# EAGLE design rcps2keyb_v2 (EAGLE 9.6.2)
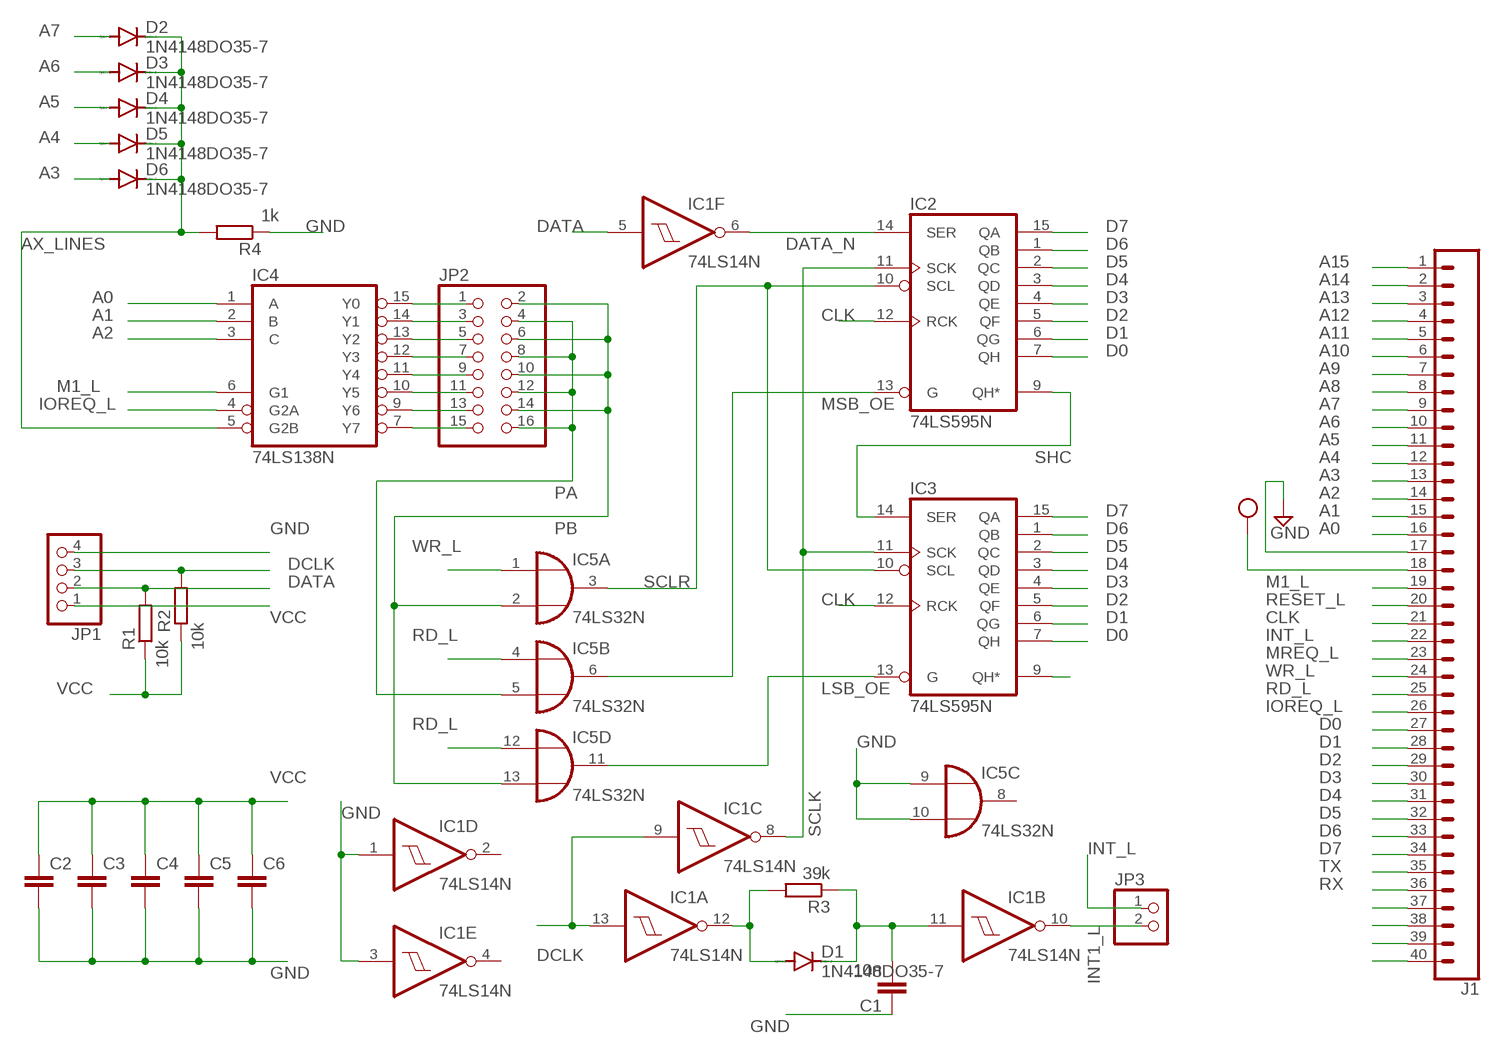
[diagram p0: schematic, sheet 1]

## Parts
C1  10n  C-EU050-025X075  [C050-025X075]
C2  C-EU050-025X075  [C050-025X075]
C3  C-EU050-025X075  [C050-025X075]
C4  C-EU050-025X075  [C050-025X075]
C5  C-EU050-025X075  [C050-025X075]
C6  C-EU050-025X075  [C050-025X075]
D1  1N4148DO35-7  [DO35-7]
D2  1N4148DO35-7  [DO35-7]
D3  1N4148DO35-7  [DO35-7]
D4  1N4148DO35-7  [DO35-7]
D5  1N4148DO35-7  [DO35-7]
D6  1N4148DO35-7  [DO35-7]
IC1  74LS14N  [DIL14]
IC2  74LS595N  [DIL16]
IC3  74LS595N  [DIL16]
IC4  74LS138N  [DIL16]
IC5  74LS32N  [DIL14]
J1  CONN_40OFFSET  [1X40_OFFSET]
JP1  PINHD-1X4  [1X04]
JP2  PINHD-2X8  [2X08]
JP3  PINHD-1X2  [1X02]
R1  10k  R-EU_0204/7  [0204/7]
R2  10k  R-EU_0204/7  [0204/7]
R3  39k  R-EU_0204/7  [0204/7]
R4  1k  R-EU_0204/7  [0204/7]

## Nets
A0: IC4.1(A) J1.16
A1: IC4.2(B) J1.15
A2: IC4.3(C) J1.14
A3: D6.A J1.13
A4: D5.A J1.12
A5: D4.A J1.11
A6: D3.A J1.10
A7: D2.A J1.9
A8: J1.8
A9: J1.7
A10: J1.6
A11: J1.5
A12: J1.4
A13: J1.3
A14: J1.2
A15: J1.1
AX_LINES: D2.C D3.C D4.C D5.C D6.C IC4.5(G2B) R4.2
CLK: IC2.12(RCK) IC3.12(RCK) J1.21
D0: IC2.7(QH) IC3.7(QH) J1.27
D1: IC2.6(QG) IC3.6(QG) J1.28
D2: IC2.5(QF) IC3.5(QF) J1.29
D3: IC2.4(QE) IC3.4(QE) J1.30
D4: IC2.3(QD) IC3.3(QD) J1.31
D5: IC2.2(QC) IC3.2(QC) J1.32
D6: IC2.1(QB) IC3.1(QB) J1.33
D7: IC2.15(QA) IC3.15(QA) J1.34
DATA: IC1.5(F:I) JP1.2 R1.2
DATA_N: IC1.6(F:O) IC2.14(SER)
DCLK: IC1.9(C:I) IC1.13(A:I) JP1.3 R2.2
GND: C1.1 C2.2 C3.2 C4.2 C5.2 C6.2 IC1.1(D:I) IC1.3(E:I) IC5.9(C:I0) IC5.10(C:I1) J1.17 JP1.4 R4.1
INT1_L: IC1.10(B:O) JP3.2
INT_L: J1.22 JP3.1
IOREQ_L: IC4.4(G2A) J1.26
LSB_OE: IC3.13(G) IC5.11(D:O)
M1_L: IC4.6(G1) J1.19
MREQ_L: J1.23
MSB_OE: IC2.13(G) IC5.6(B:O)
N$1: J1.37
N$2: J1.38
N$3: J1.39
N$4: D1.A IC1.12(A:O) R3.2
N$5: C1.2 D1.C IC1.11(B:I) R3.1
N$13: J1.40
N$17: IC4.7(Y7) JP2.15
N$18: IC4.9(Y6) JP2.13
N$19: IC4.10(Y5) JP2.11
N$20: IC4.15(Y0) JP2.1
N$21: IC4.14(Y1) JP2.3
N$22: IC4.13(Y2) JP2.5
N$23: IC4.12(Y3) JP2.7
N$24: IC4.11(Y4) JP2.9
N$41: IC3.9(QH*)
PA: IC5.5(B:I1) JP2.4 JP2.8 JP2.12 JP2.16
PB: IC5.2(A:I1) IC5.13(D:I1) JP2.2 JP2.6 JP2.10 JP2.14
RD_L: IC5.4(B:I0) IC5.12(D:I0) J1.25
RESET_L: J1.20
RX: J1.36
SCLK: IC1.8(C:O) IC2.11(SCK) IC3.11(SCK)
SCLR: IC2.10(SCL) IC3.10(SCL) IC5.3(A:O)
SHC: IC2.9(QH*) IC3.14(SER)
TX: J1.35
VCC: C2.1 C3.1 C4.1 C5.1 C6.1 J1.18 JP1.1 R1.1 R2.1
WR_L: IC5.1(A:I0) J1.24
Unconnected: IC1.2(D:O) IC1.4(E:O) IC5.8(C:O)

## Power pins joined to a net without a drawn wire
GND: IC1.7(P:GND) IC2.8(GND) IC3.8(GND) IC4.8(GND) IC5.7(P:GND)
VCC: IC1.14(P:VCC) IC2.16(VCC) IC3.16(VCC) IC4.16(VCC) IC5.14(P:VCC)

## Library data of the parts
C1 = rcl:C-EU: CAPACITOR, European symbol; SPICEPREFIX: C
C2-C6 = LabE:C-EU: CAPACITOR, European symbol; SPICEPREFIX: C
D1-D6 = diode:1N4148: DIODE high speed (Philips)
IC1 = 74xx-eu:74*14: Hex schmitt trigger INVERTER
IC2 IC3 = 74xx-eu:74*595: 8-bit SHIFT REGISTER, output latch
IC4 = 74xx-eu:74*138: 3-line to 8-line DECODER/DEMULTIPLEXER
IC5 = 74xx-eu:74*32: Quad 2-input OR gate
J1 = SparkFun-Connectors:CONN_40: Multi connection point. Often used as Generic Header-pin footprint for 0.1 inch spaced/style header connections On any of the 0.1 inch spaced packages, you can populate with these: Break Away Headers - Straight <https://www.sparkfun.com/products/116> (PRT-00116) Break Away Male Headers - Right Angle <https://www.sparkfun.com/products/553> (PRT-00553) Female Headers <https://www.sparkfun.com/products/115> (PRT-00115) Break Away Headers - Machine Pin <https://www.sparkfun.com/products/117> (PRT-00117) Break Away Female Headers - Swiss Machine Pin <https://www.sparkfun.com/products/743> (PRT-00743) For SCREWTERMINALS and SPRING TERMINALS visit here: Screw Terimnals on SparkFun.com <https://www.sparkfun.com/search/results?term=Screw+Terminals> (5mm/3.5mm/2.54mm spacing) This device is also useful as a general connection point to wire up your design to another part of your project. Our various solder wires solder well into these plated through hole pads. Hook-Up Wire - Assortment (Stranded, 22 AWG) <https://www.sparkfun.com/products/11375> (PRT-11375) Hook-Up Wire - Assortment (Solid Core, 22 AWG) <https://www.sparkfun.com/products/11367> (PRT-11367) View the entire wire category on our website here <https://www.sparkfun.com/categories/141> Special notes: Molex polarized connector foot print use with SKU : PRT-08231 with associated crimp pins and housings. 1MM SMD Version SKU: PRT-10208 NOTES ON THE VARIANTS LOCK and LOCK_LONGPADS... This footprint was designed to help hold the alignment of a through-hole component (i.e. 6-pin header) while soldering it into place. You may notice that each hole has been shifted either up or down by 0.005 of an inch from it's more standard position (which is a perfectly straight line). This slight alteration caused the pins (the squares in the middle) to touch the edges of the holes. Because they are alternating, it causes a "brace" to hold the component in place. 0.005 has proven to be the perfect amount of "off-center" position when using our standard breakaway headers. Although looks a little odd when you look at the bare footprint, once you have a header in there, the alteration is very hard to notice. Also,if you push a header all the way into place, it is covered up entirely on the bottom side.
JP1 = pinhead:PINHD-1X4: PIN HEADER
JP2 = pinhead:PINHD-2X8: PIN HEADER
JP3 = pinhead:PINHD-1X2: PIN HEADER
R1-R4 = rcl:R-EU_: RESISTOR, European symbol; SPICEPREFIX: R

## Board
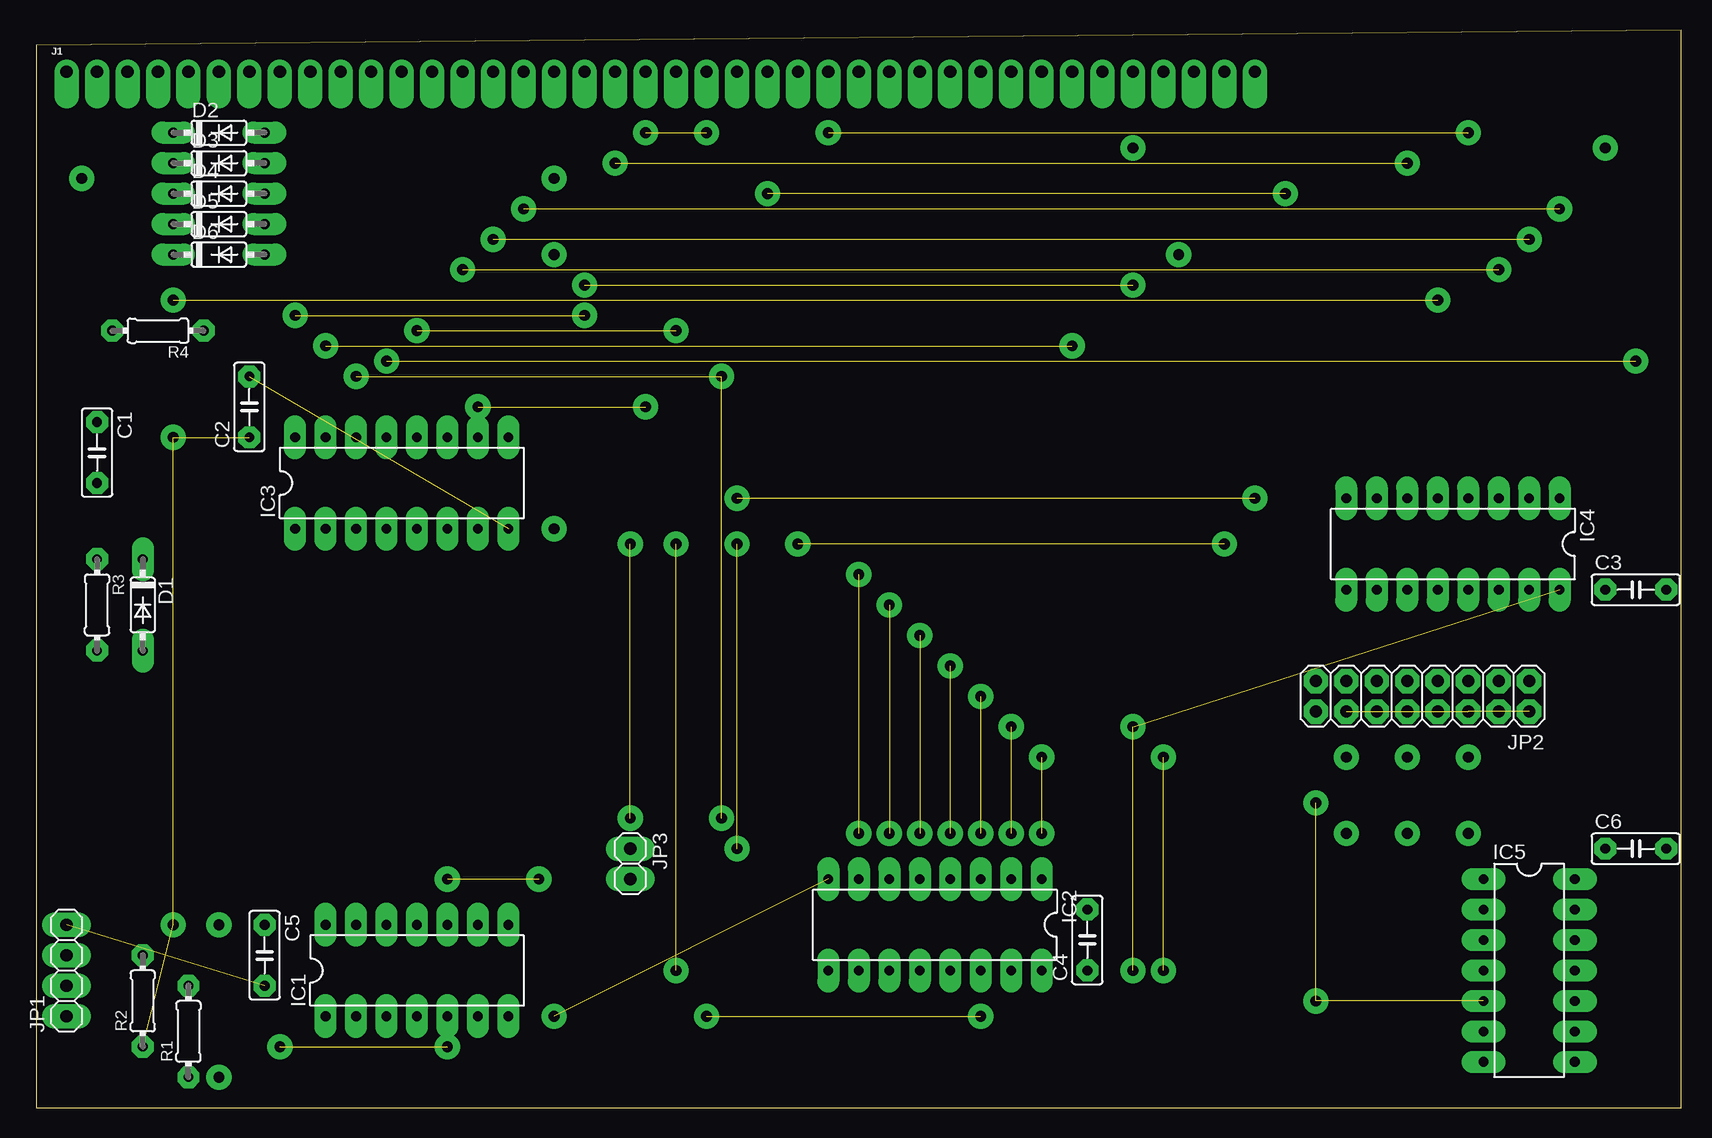
[diagram p1: board, top side]
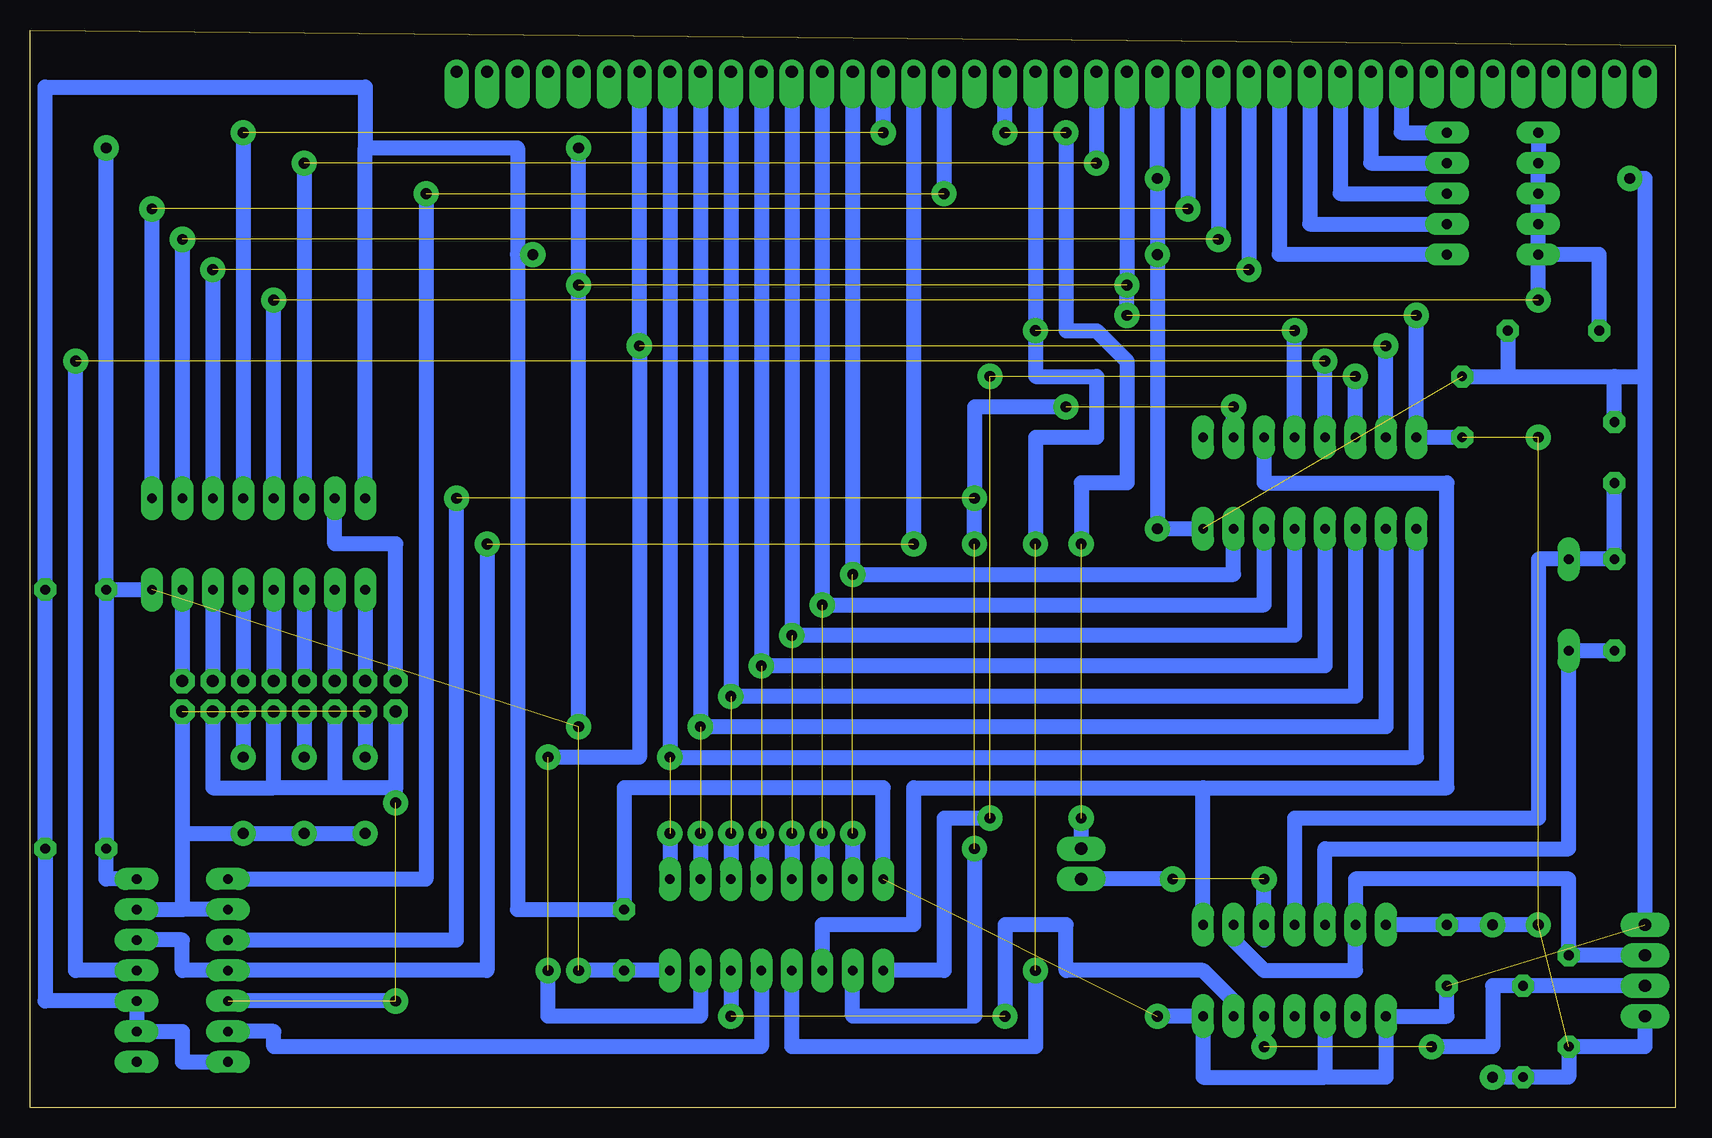
[diagram p2: board, bottom side, seen from below]

Size 137.14 x 89.84 mm. Coordinates in mm from the lower left corner, seen from the top.
Outline: 0,0 137.14,0 137.14,89.84 0,88.57 0,0
Copper layers (1*16): Top 0.035mm / dielectric 1.5mm / Bottom 0.035mm
Design rules "LabE": minimum track width 50mil, minimum drill 0.8mm, track to track 16mil, track to pad 16mil, pad to pad 16mil, via to via 16mil, smd to smd 16mil, copper to edge 0mil, drill to drill 16mil, minimum pad ring 20mil, minimum via ring 20mil, stop-mask expansion 4mil, vias tented up to drill 0mil, thermal gap 10mil

### Footprints (pad centres in the part's own frame; a part is rotated, then mirrored left to right if it is on the bottom)
C050-025X075 = drill 0.813 octagon: 1 -2.54,0; 2 2.54,0
DO35-7 = drill 0.813 long: A 3.81,0; C -3.81,0
DIL14 = drill 0.813 long: 1 -7.62,-3.81; 2 -5.08,-3.81; 3 -2.54,-3.81; 4 0,-3.81; 5 2.54,-3.81; 6 5.08,-3.81; 7 7.62,-3.81; 8 7.62,3.81; 9 5.08,3.81; 10 2.54,3.81; 11 0,3.81; 12 -2.54,3.81; 13 -5.08,3.81; 14 -7.62,3.81
DIL16 = drill 0.813 long: 1 -8.89,-3.81; 2 -6.35,-3.81; 3 -3.81,-3.81; 4 -1.27,-3.81; 5 1.27,-3.81; 6 3.81,-3.81; 7 6.35,-3.81; 8 8.89,-3.81; 9 8.89,3.81; 10 6.35,3.81; 11 3.81,3.81; 12 1.27,3.81; 13 -1.27,3.81; 14 -3.81,3.81; 15 -6.35,3.81; 16 -8.89,3.81
1X40_OFFSET = drill 1.016 pad 1.88 offset: 1 0,0; 2 2.54,0; 3 5.08,0; 4 7.62,0; 5 10.16,0; 6 12.7,0; 7 15.24,0; 8 17.78,0; 9 20.32,0; 10 22.86,0; 11 25.4,0; 12 27.94,0; 13 30.48,0; 14 33.02,0; 15 35.56,0; 16 38.1,0; 17 40.64,0; 18 43.18,0; 19 45.72,0; 20 48.26,0; 21 50.8,0; 22 53.34,0; 23 55.88,0; 24 58.42,0; 25 60.96,0; 26 63.5,0; 27 66.04,0; 28 68.58,0; 29 71.12,0; 30 73.66,0; 31 76.2,0; 32 78.74,0; 33 81.28,0; 34 83.82,0; 35 86.36,0; 36 88.9,0; 37 91.44,0; 38 93.98,0; 39 96.52,0; 40 99.06,0
1X04 = drill 1.016 long: 1 -3.81,0; 2 -1.27,0; 3 1.27,0; 4 3.81,0
2X08 = drill 1.016 octagon: 1 -8.89,-1.27; 2 -8.89,1.27; 3 -6.35,-1.27; 4 -6.35,1.27; 5 -3.81,-1.27; 6 -3.81,1.27; 7 -1.27,-1.27; 8 -1.27,1.27; 9 1.27,-1.27; 10 1.27,1.27; 11 3.81,-1.27; 12 3.81,1.27; 13 6.35,-1.27; 14 6.35,1.27; 15 8.89,-1.27; 16 8.89,1.27
1X02 = drill 1.016 long: 1 -1.27,0; 2 1.27,0
0204/7 = drill 0.813 octagon: 1 -3.81,0; 2 3.81,0

### Placement (x,y rotation side)
C1  5.08,54.61 270 top
C2  17.78,58.42 90 top
C3  133.35,43.18 0 top
C4  87.63,13.97 90 top
C5  19.05,12.7 270 top
C6  133.35,21.59 0 top
D1  8.89,41.91 270 top
D2  15.24,81.28 0 top
D3  15.24,78.74 0 top
D4  15.24,76.2 0 top
D5  15.24,73.66 0 top
D6  15.24,71.12 0 top
IC1  31.75,11.43 0 top
IC2  74.93,15.24 180 top
IC3  30.48,52.07 0 top
IC4  118.11,46.99 180 top
IC5  124.46,11.43 270 top
J1  2.54,86.36 0 top
JP1  2.54,11.43 90 top
JP2  115.57,34.29 180 top
JP3  49.53,20.32 270 top
R1  12.7,6.35 90 top
R2  8.89,8.89 90 top
R3  5.08,41.91 270 top
R4  10.16,64.77 180 top

### Tracks (layer width: path | path; a pad name or v marks a point on that pad's centre or on a via)
A0  (via drill 0.9 pad 2.1)  (1 unrouted)
  Bottom 1.27: J1.16 v40.64,74.93 | v127,74.93 IC4.1
A1  (via drill 0.9 pad 2.1)  (1 unrouted)
  Bottom 1.27: J1.15 v38.1,72.39 | v124.46,72.39 IC4.2
A2  (via drill 0.9 pad 2.1)  (1 unrouted)
  Bottom 1.27: J1.14 v35.56,69.85 | v121.92,69.85 IC4.3
A3
  Bottom 1.27: J1.13 33.02,71.12 D6.A
A4
  Bottom 1.27: J1.12 30.48,73.66 D5.A
A5
  Bottom 1.27: J1.11 27.94,76.2 D4.A
A6
  Bottom 1.27: J1.10 25.4,78.74 D3.A
A7
  Bottom 1.27: J1.9 22.86,81.28 D2.A
AX_LINES  (via drill 0.9 pad 2.1)  (1 unrouted)
  Bottom 1.27: D2.C D3.C | D3.C 11.43,78.16 | R4.2 6.35,71.12 D6.C | D6.C D5.C D4.C D3.C | v11.43,67.31 D6.C | IC4.5 v116.84,67.31
CLK  (via drill 0.9 pad 2.1)  (2 unrouted)
  Bottom 1.27: IC2.12 73.66,5.08 53.34,5.08 v53.34,11.43 | IC3.12 v31.75,64.77 | J1.21 v53.34,64.77 53.34,60.96 48.26,60.96 48.26,55.88 53.34,55.88 v53.34,46.99
D0  (via drill 0.9 pad 2.1)  (1 unrouted)
  Bottom 1.27: IC3.7 36.83,44.45 v68.58,44.45 J1.27 | v68.58,22.86 IC2.7
D1  (via drill 0.9 pad 2.1)  (1 unrouted)
  Bottom 1.27: IC3.6 34.29,41.91 v71.12,41.91 J1.28 | v71.12,22.86 IC2.6
D2  (via drill 0.9 pad 2.1)  (1 unrouted)
  Bottom 1.27: IC3.5 31.75,39.37 v73.66,39.37 J1.29 | v73.66,22.86 IC2.5
D3  (via drill 0.9 pad 2.1)  (1 unrouted)
  Bottom 1.27: IC3.4 29.21,36.83 v76.2,36.83 J1.30 | v76.2,22.86 IC2.4
D4  (via drill 0.9 pad 2.1)  (1 unrouted)
  Bottom 1.27: IC3.3 26.67,34.29 v78.74,34.29 J1.31 | v78.74,22.86 IC2.3
D5  (via drill 0.9 pad 2.1)  (1 unrouted)
  Bottom 1.27: IC3.2 24.13,31.75 v81.28,31.75 J1.32 | v81.28,22.86 IC2.2
D6  (via drill 0.9 pad 2.1)  (1 unrouted)
  Bottom 1.27: IC3.1 21.59,29.21 v83.82,29.21 J1.33 | v83.82,22.86 IC2.1
D7  (via drill 0.9 pad 2.1)  (2 unrouted)
  Bottom 1.27: IC3.15 v24.13,63.5 | J1.34 v86.36,63.5 86.36,29.21 v93.98,29.21 | IC2.15 81.28,7.62 93.98,7.62 v93.98,11.43
DATA  (via drill 0.9 pad 2.1)  (1 unrouted)
  Bottom 1.27: JP1.2 R1.2 15.24,10.16 15.24,5.08 v20.32,5.08 | v34.29,5.08 IC1.5
DATA_N  (via drill 0.9 pad 2.1)  (1 unrouted)
  Bottom 1.27: IC2.14 v78.74,7.62 | IC1.6 36.83,8.89 39.37,11.43 50.8,11.43 50.8,15.24 55.88,15.24 v55.88,7.62
DCLK
  Bottom 1.27: JP1.3 R2.2 8.89,19.05 26.67,19.05 IC1.13 26.67,11.43 34.29,11.43 36.83,13.97 IC1.9
GND  (via drill 0.9 pad 2.1)  (3 unrouted)
  Bottom 1.27: IC3.8 v43.18,48.26 v43.18,71.12 v43.18,77.47 J1.17 | C5.2 19.05,7.62 IC1.1 24.13,2.54 29.21,2.54 | IC1.3 29.21,2.54 | v3.81,77.47 2.54,77.47 2.54,60.96 | 2.54,60.96 JP1.4 | C2.2 13.97,60.96 | 13.97,60.96 5.08,60.96 | 5.08,60.96 2.54,60.96 | IC5.7 124.46,3.81 124.46,6.35 IC5.9 IC5.10 135.89,8.89 C6.2 C3.2 135.89,85.09 109.22,85.09 109.22,80.01 | IC4.8 109.22,80.01 | 109.22,80.01 96.52,80.01 96.52,71.12 | 96.52,71.12 96.52,16.51 C4.2 87.63,26.67 66.04,26.67 IC2.8 | 96.52,71.12 v95.25,71.12 | C1.1 5.08,60.96 | 29.21,2.54 39.37,2.54 IC1.7 v43.18,7.62 | R4.1 13.97,60.96
INT1_L  (via drill 0.9 pad 2.1)  (1 unrouted)
  Bottom 1.27: v34.29,19.05 IC1.10 34.29,13.97 | v41.91,19.05 JP3.2
INT_L  (via drill 0.9 pad 2.1)  (2 unrouted)
  Bottom 1.27: v55.88,81.28 J1.22 | v50.8,81.28 50.8,64.77 48.26,64.77 45.72,62.23 45.72,52.07 49.53,52.07 v49.53,46.99 | JP3.1 v49.53,24.13
IOREQ_L  (via drill 0.9 pad 2.1)  (1 unrouted)
  Bottom 1.27: J1.26 v66.04,81.28 | v119.38,81.28 IC4.4
LSB_OE  (via drill 0.9 pad 2.1)  (1 unrouted)
  Bottom 1.27: IC3.13 v29.21,62.23 | IC5.11 133.35,11.43 v133.35,62.23
M1_L  (via drill 0.9 pad 2.1)  (1 unrouted)
  Bottom 1.27: J1.19 v48.26,78.74 | v114.3,78.74 IC4.6
MSB_OE
  Bottom 1.27: IC2.13 76.2,5.08 116.84,5.08 116.84,6.35 IC5.6
N$4
  Bottom 1.27: IC1.12 29.21,21.59 8.89,21.59 D1.A R3.2
N$5
  Bottom 1.27: IC1.11 31.75,24.13 11.43,24.13 11.43,45.72 D1.C R3.1 C1.2
N$17
  Bottom 1.27: JP2.15 106.68,46.99 111.76,46.99 IC4.7
N$18
  Bottom 1.27: IC4.9 JP2.13
N$19
  Bottom 1.27: IC4.10 JP2.11
N$20
  Bottom 1.27: IC4.15 JP2.1
N$21
  Bottom 1.27: IC4.14 JP2.3
N$22
  Bottom 1.27: IC4.13 JP2.5
N$23
  Bottom 1.27: IC4.12 JP2.7
N$24
  Bottom 1.27: IC4.11 JP2.9
PA  (via drill 0.9 pad 2.1)  (2 unrouted)
  Bottom 1.27: JP2.16 106.68,26.67 | 106.68,26.67 111.76,26.67 | JP2.12 111.76,26.67 | 111.76,26.67 116.84,26.67 | 116.84,26.67 JP2.8 | 116.84,26.67 121.92,26.67 JP2.4 | v106.68,8.89 IC5.5 | v106.68,25.4 106.68,26.67
PB  (via drill 0.9 pad 2.1)  (3 unrouted)
  Bottom 1.27: v109.22,22.86 v114.3,22.86 v119.38,22.86 124.46,22.86 | IC5.2 124.46,16.51 | 124.46,22.86 124.46,16.51 | IC5.13 124.46,16.51 | JP2.14 v109.22,29.21 | JP2.10 v114.3,29.21 | JP2.6 v119.38,29.21 | JP2.2 124.46,22.86
RD_L  (via drill 0.9 pad 2.1)  (1 unrouted)
  Bottom 1.27: v99.06,46.99 99.06,11.43 IC5.4 124.46,11.43 124.46,13.97 IC5.12 | J1.25 v63.5,46.99
SCLK
  Bottom 1.27: IC3.11 34.29,52.07 19.05,52.07 19.05,26.67 39.37,26.67 | 39.37,26.67 63.5,26.67 63.5,15.24 71.12,15.24 IC2.11 | IC1.8 39.37,26.67
SCLR  (via drill 0.9 pad 2.1)  (3 unrouted)
  Bottom 1.27: IC3.10 v36.83,58.42 | v50.8,58.42 58.42,58.42 v58.42,50.8 v58.42,46.99 | IC2.10 68.58,7.62 58.42,7.62 v58.42,21.59 | IC5.3 101.6,13.97 v101.6,50.8
SHC  (via drill 0.9 pad 2.1)  (2 unrouted)
  Bottom 1.27: IC3.14 v26.67,60.96 | v57.15,24.13 60.96,24.13 60.96,11.43 IC2.9
  other vias: 57.15,60.96
VCC  (via drill 0.9 pad 2.1)  (7 unrouted)
  Bottom 1.27: JP1.1 2.54,5.08 R2.1 8.89,2.54 R1.1 v15.24,2.54 | IC1.14 C5.1 v15.24,15.24 v11.43,15.24 | IC2.16 C4.1 v91.44,11.43 | C2.1 IC3.16 v21.59,66.04 | v45.72,66.04 v45.72,68.58 J1.18 | v91.44,80.01 v91.44,68.58 v91.44,31.75 | C3.1 v130.81,80.01 | C3.1 IC4.16 | C3.1 C6.1 130.81,19.05 IC5.14
  other vias: 11.43,55.88
WR_L  (via drill 0.9 pad 2.1)  (1 unrouted)
  Bottom 1.27: IC5.1 104.14,19.05 v104.14,76.2 | J1.24 v60.96,76.2